# EAGLE design arduino_fio (EAGLE 5.00)
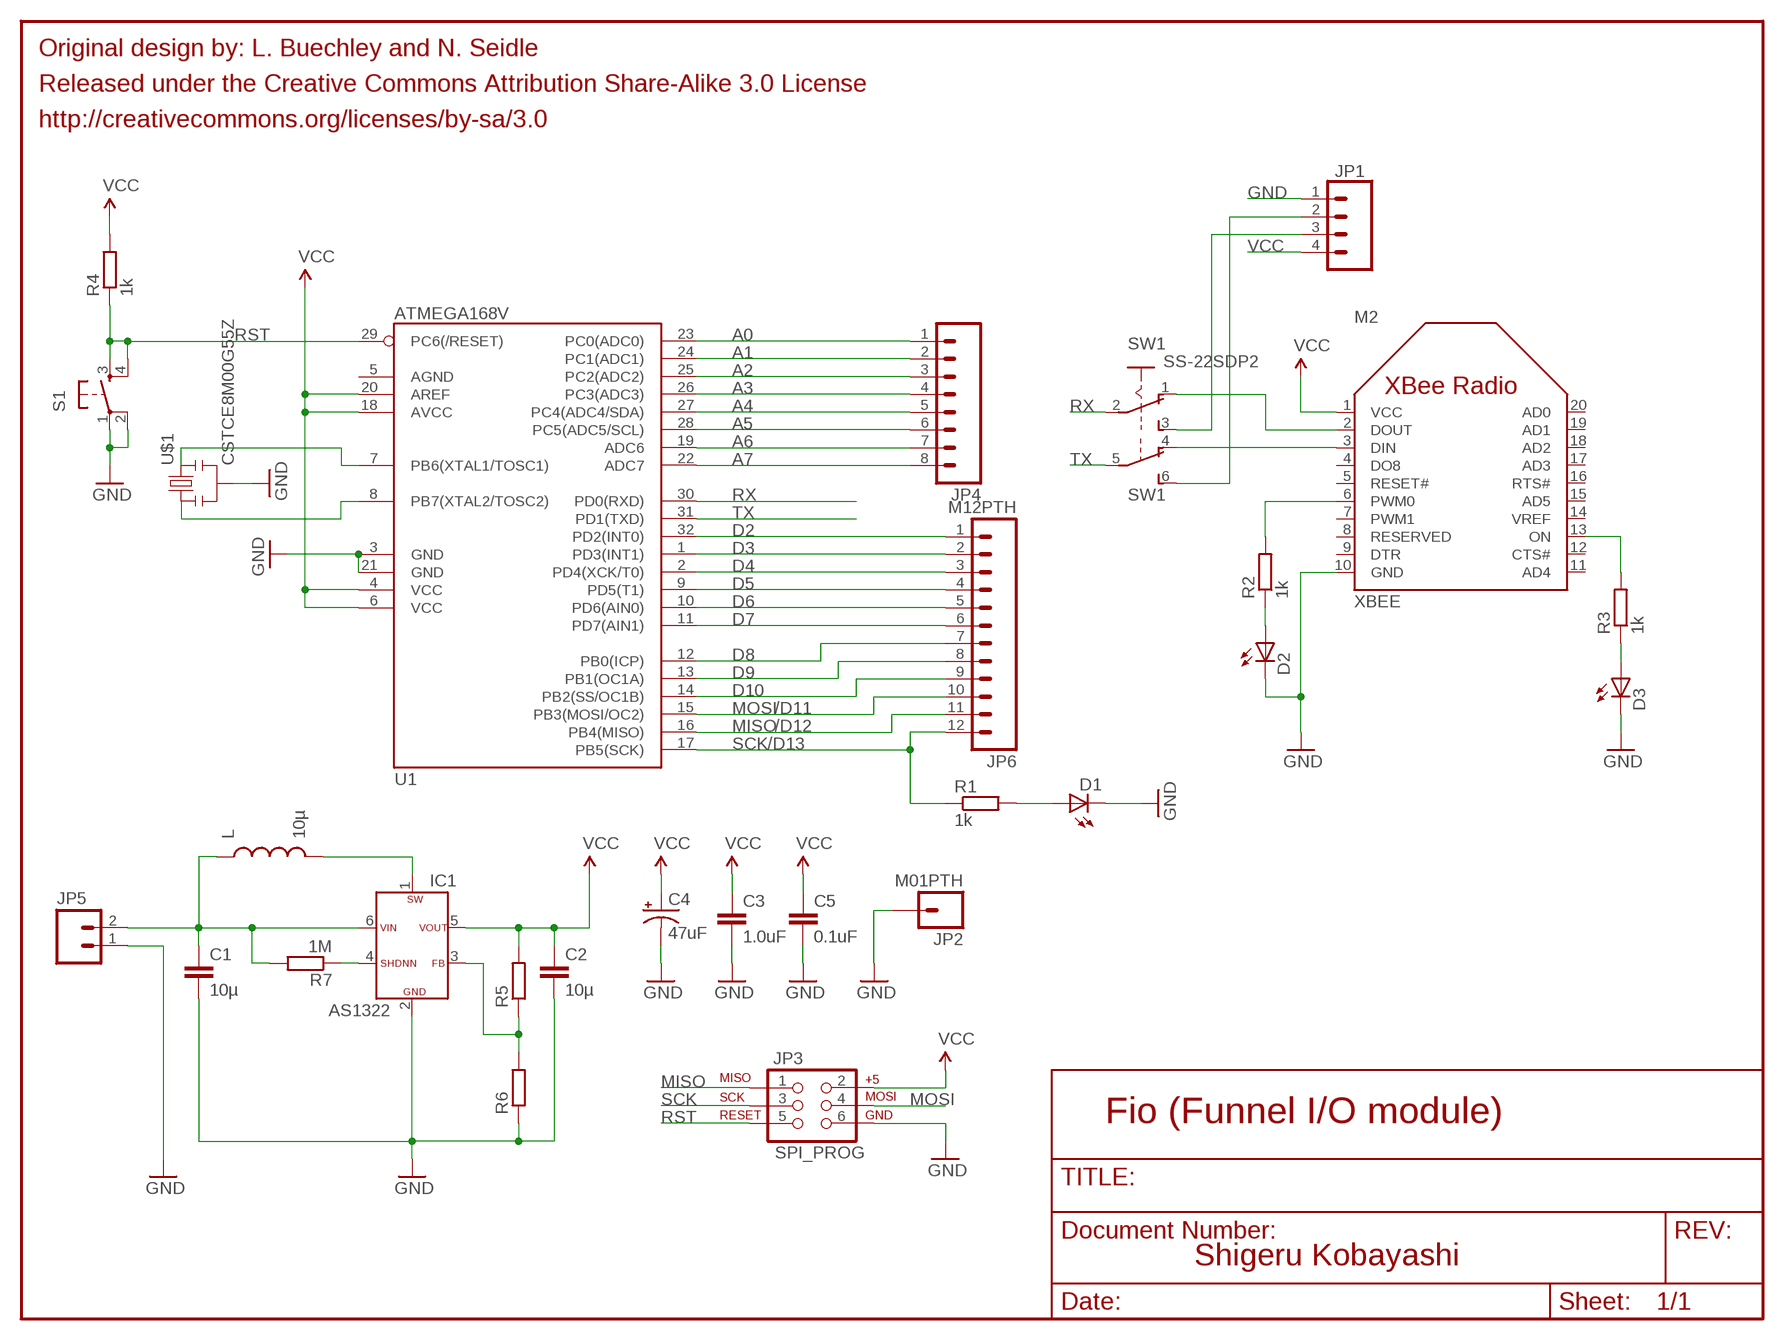
[diagram p0: schematic, sheet 1]

## Parts
C1  10µ  C-EUC0805K  [C0805K]
C2  10µ  C-EUC0805K  [C0805K]
C3  1.0uF  CAP0603  [0603]
C4  47uF  CAP_POL3528  [EIA3528]
C5  0.1uF  CAP0603  [0603]
D1  LEDCHIPLED_0805  [CHIPLED_0805]
D2  LEDCHIPLED_0805  [CHIPLED_0805]
D3  LEDCHIPLED_0805  [CHIPLED_0805]
IC1  AS1322  [SOT23-6]
JP1  Serial  M04PTH  [1X04]
JP2  M01PTH  [1X01]
JP3  SPI_PROG  AVR_SPI_PRG_6NS  [2X3-NS]
JP4  M08  [1X08]
JP5  M02-JST-2MM-SMT  [S2B-PH]
JP6  M12PTH  [1X12]
L  10µ  A921CY  [D63LCB]
M2  XBEE  [XBEE]
R1  1k  R-EU_R0603  [R0603]
R2  1k  R-EU_R0603  [R0603]
R3  1k  R-EU_R0603  [R0603]
R4  1k  R-EU_R0603  [R0603]
R5  R-EU_R0603  [R0603]
R6  R-EU_R0603  [R0603]
R7  1M  R-EU_R0603  [R0603]
S1  TAC_SWITCHSND  [TACTILE_SWITCH_SMD]
SW1  SS-22SDP2  [SS-22SDP2]
U1  ATMEGA168V  ATMEGA168  [TQFP32-08]
U$1  CSTCE8M00G55Z  RESONATORSMD  [RESONATOR-SMD]

## Nets
A0: JP4.1 U1.23(PC0(ADC0))
A1: JP4.2 U1.24(PC1(ADC1))
A2: JP4.3 U1.25(PC2(ADC2))
A3: JP4.4 U1.26(PC3(ADC3))
A4: JP4.5 U1.27(PC4(ADC4/SDA))
A5: JP4.6 U1.28(PC5(ADC5/SCL))
A6: JP4.7 U1.19(ADC6)
A7: JP4.8 U1.22(ADC7)
D2: JP6.1 U1.32(PD2(INT0))
D3: JP6.2 U1.1(PD3(INT1))
D4: JP6.3 U1.2(PD4(XCK/T0))
D5: JP6.4 U1.9(PD5(T1))
D6: JP6.5 U1.10(PD6(AIN0))
D7: JP6.6 U1.11(PD7(AIN1))
D8: JP6.7 U1.12(PB0(ICP))
D9: JP6.8 U1.13(PB1(OC1A))
D10: JP6.9 U1.14(PB2(SS/OC1B))
GND [VCC]: C1.2 C2.2 C3.2 C4.C(-) C5.2 D1.C D2.C D3.C IC1.2(GND) JP1.1 JP2.1 JP3.6 JP5.1 M2.10(GND) R6.1 S1.1 S1.2 U1.3(GND) U1.21(GND) U$1.2
MISO: JP3.1 JP6.11 U1.16(PB4(MISO))
MOSI: JP3.4 JP6.10 U1.15(PB3(MOSI/OC2))
N$1: M2.13(ON) R3.2
N$2: D1.A R1.2
N$3: D2.A R2.1
N$4: M2.6(PWM0) R2.2
N$5: M2.2(DOUT) SW1.1(O)
N$6: D3.A R3.1
N$7: M2.3(DIN) SW1.4(O)
N$8: JP1.2 SW1.6(S)
N$9: JP1.3 SW1.3(S)
N$10: U1.7(PB6(XTAL1/TOSC1)) U$1.3
N$11: IC1.3(FB) R5.1 R6.2
N$12: U1.8(PB7(XTAL2/TOSC2)) U$1.1
N$13: C1.1 IC1.6(VIN) JP5.2 L.P$1 R7.2
N$14: IC1.1(SW) L.P$2
N$15: IC1.4(SHDNN) R7.1
RST: JP3.5 R4.1 S1.3 S1.4 U1.29(PC6(/RESET))
RX: SW1.2(P) U1.30(PD0(RXD))
SCK: JP3.3 JP6.12 R1.1 U1.17(PB5(SCK))
TX: SW1.5(P) U1.31(PD1(TXD))
VCC [VCC]: C2.1 C3.1 C4.A(+) C5.1 IC1.5(VOUT) JP1.4 JP3.2 M2.1(VCC) R4.2 R5.2 U1.4(VCC) U1.6(VCC) U1.18(AVCC) U1.20(AREF)
Unconnected: M2.4(DO8) M2.5(RESET#) M2.7(PWM1) M2.8(RESERVED) M2.9(DTR) M2.11(AD4) M2.12(CTS#) M2.14(VREF) M2.15(AD5) M2.16(RTS#) M2.17(AD3) M2.18(AD2) M2.19(AD1) M2.20(AD0) U1.5(AGND)

## Notes on the sheet
- Original design by: L. Buechley and N. Seidle
- Released under the Creative Commons Attribution Share-Alike 3.0 License
- http://creativecommons.org/licenses/by-sa/3.0
- /D11
- /D12
- /D13
- Fio (Funnel I/O module)
- Shigeru Kobayashi

## Library data of the parts
C1 C2 = rcl:C-EU: CAPACITOR, European symbol
C3 C5 = SparkFun:CAP: Capacitor Standard 0603 ceramic capacitor, and 0.1" leaded capacitor.
C4 = SparkFun:CAP_POL: Capacitor Polarized These are standard SMD and PTH capacitors. Normally 10uF, 47uF, and 100uF in electrolytic and tantalum varieties. Always verify the external diameter of the through hole cap, it varies with capacity, voltage, and manufacturer. The EIA devices should be standard.
D1-D3 = led:LED: LED OSRAM: - CHIPLED LG R971, LG N971, LY N971, LG Q971, LY Q971, LO R971, LY R971 LH N974, LH R974 LS Q976, LO Q976, LY Q976 LO Q996 - Hyper CHIPLED LW Q18S LB Q993, LB Q99A, LB R99A - SideLED LS A670, LO A670, LY A670, LG A670, LP A670 LB A673, LV A673, LT A673, LW A673 LH A674 LY A675 LS A676, LA A676, LO A676, LY A676, LW A676 LS A679, LY A679, LG A679 - Hyper Micro SIDELED® LS Y876, LA Y876, LO Y876, LY Y876 LT Y87S - SmartLED LW L88C, LW L88S LB L89C, LB L89S, LG L890 LS L89K, LO L89K, LY L89K LS L896, LA L896, LO L896, LY L896 - TOPLED LS T670, LO T670, LY T670, LG T670, LP T670 LSG T670, LSP T670, LSY T670, LOP T670, LYG T670 LG T671, LOG T671, LSG T671 LB T673, LV T673, LT T673, LW T673 LH T674 LS T676, LA T676, LO T676, LY T676, LB T676, LH T676, LSB T676, LW T676 LB T67C, LV T67C, LT T67C, LS T67K, LO T67K, LY T67K, LW E67C LS E67B, LA E67B, LO E67B, LY E67B, LB E67C, LV E67C, LT E67C LW T67C LS T679, LY T679, LG T679 LS T770, LO T770, LY T770, LG T770, LP T770 LB T773, LV T773, LT T773, LW T773 LH T774 LS E675, LA E675, LY E675, LS T675 LS T776, LA T776, LO T776, LY T776, LB T776 LHGB T686 LT T68C, LB T68C - Hyper Mini TOPLED® LB M676 - Mini TOPLED Santana® LG M470 LS M47K, LO M47K, LY M47K Source: http://www.osram.convergy.de - LUMILED® LXK2-PW12-R00, LXK2-PW12-S00, LXK2-PW14-U00, LXK2-PW14-V00 LXK2-PM12-R00, LXK2-PM12-S00, LXK2-PM14-U00 LXK2-PE12-Q00, LXK2-PE12-R00, LXK2-PE12-S00, LXK2-PE14-T00, LXK2-PE14-U00 LXK2-PB12-K00, LXK2-PB12-L00, LXK2-PB12-M00, LXK2-PB14-N00, LXK2-PB14-P00, LXK2-PB14-Q00 LXK2-PR12-L00, LXK2-PR12-M00, LXK2-PR14-Q00, LXK2-PR14-R00 LXK2-PD12-Q00, LXK2-PD12-R00, LXK2-PD12-S00 LXK2-PH12-R00, LXK2-PH12-S00 LXK2-PL12-P00, LXK2-PL12-Q00, LXK2-PL12-R00 Source: www.luxeon.com
IC1 = austriamicrosystems_as1322:AS1322
JP1 = SparkFun:M04: Header 4 Standard 4-pin 0.1" header. Use with straight break away headers (SKU : PRT-00116), right angle break away headers (PRT-00553), swiss pins (PRT-00743), machine pins (PRT-00117), and female headers (PRT-00115). Molex polarized connector foot print use with SKU : PRT-08231 with associated crimp pins and housings.
JP2 = SparkFun:M01: Header 1 Standard 1-pin 0.1" header. Use with straight break away headers (SKU : PRT-00116), right angle break away headers (PRT-00553), swiss pins (PRT-00743), machine pins (PRT-00117), and female headers (PRT-00115).
JP3 = SparkFun:AVR_SPI_PRG_6
JP4 = SparkFun:M08: Header 8 Standard 8-pin 0.1" header. Use with straight break away headers (SKU : PRT-00116), right angle break away headers (PRT-00553), swiss pins (PRT-00743), machine pins (PRT-00117), and female headers (PRT-00115).
JP5 = SparkFun:M02: Header 2 Standard 2-pin 0.1" header. Use with straight break away headers (SKU : PRT-00116), right angle break away headers (PRT-00553), swiss pins (PRT-00743), machine pins (PRT-00117), and female headers (PRT-00115). Molex polarized connector foot print use with SKU : PRT-08233 with associated crimp pins and housings.
JP6 = SparkFun:M12: Header 12 Standard 12-pin 0.1" header. Use with straight break away headers (SKU : PRT-00116), right angle break away headers (PRT-00553), swiss pins (PRT-00743), machine pins (PRT-00117), and female headers (PRT-00115).
L = inductor_toko:A921CY
M2 = digi_xbee:XBEE
R1-R7 = rcl:R-EU_: RESISTOR, European symbol
S1 = SparkFun:TAC_SWITCH: Momentary Switch Button commonly used for reset or general input. Spark Fun Electronics SKU : COM-00097
SW1 = nikkai_ss:SS-22S
U1 = SparkFun:ATMEGA168
U$1 = SparkFun:RESONATOR: Resonator Small SMD resonator. This is the itty bitty 10/20MHz resonators with built in caps. CSTCE10M0G55 and CSTCE20M0V53. Footprint has been reviewed closely but hasn't been tested yet.

## Net classes
0 Default: width 0.203 mm
1 VCC: width 0.381 mm
2 LEDPower: width 0.203 mm
3 ButtonSignal: width 0.203 mm

## Board
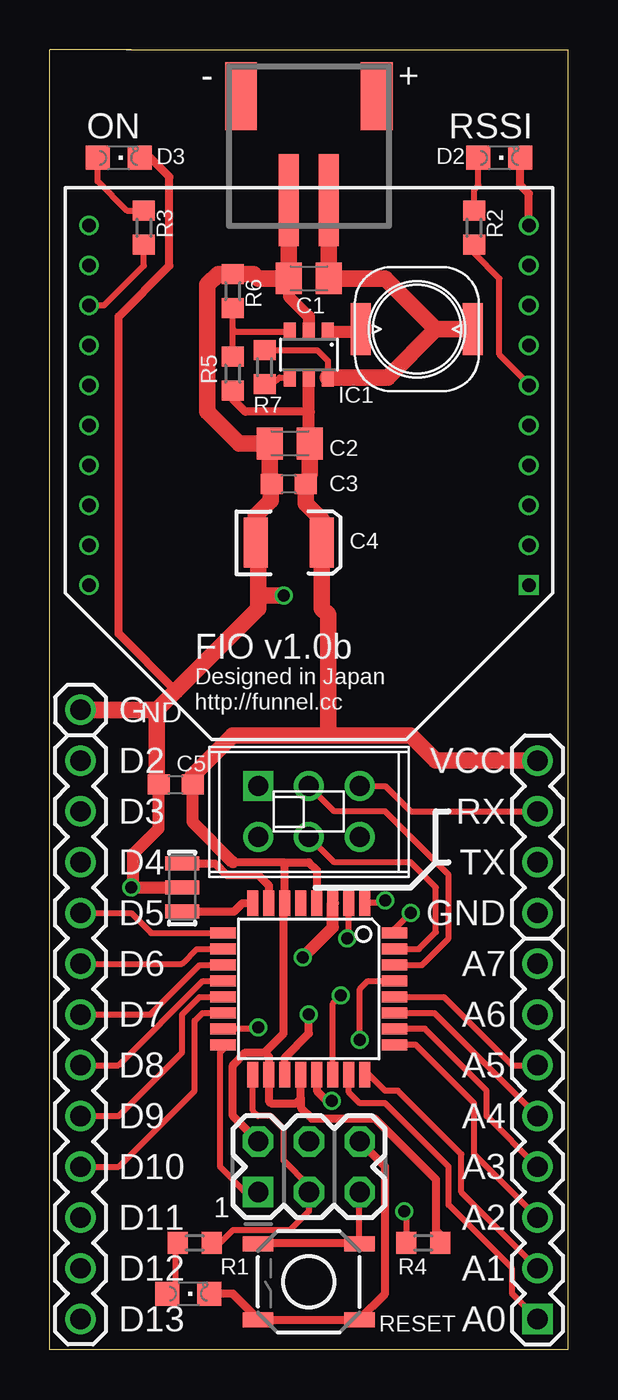
[diagram p1: board, top side]
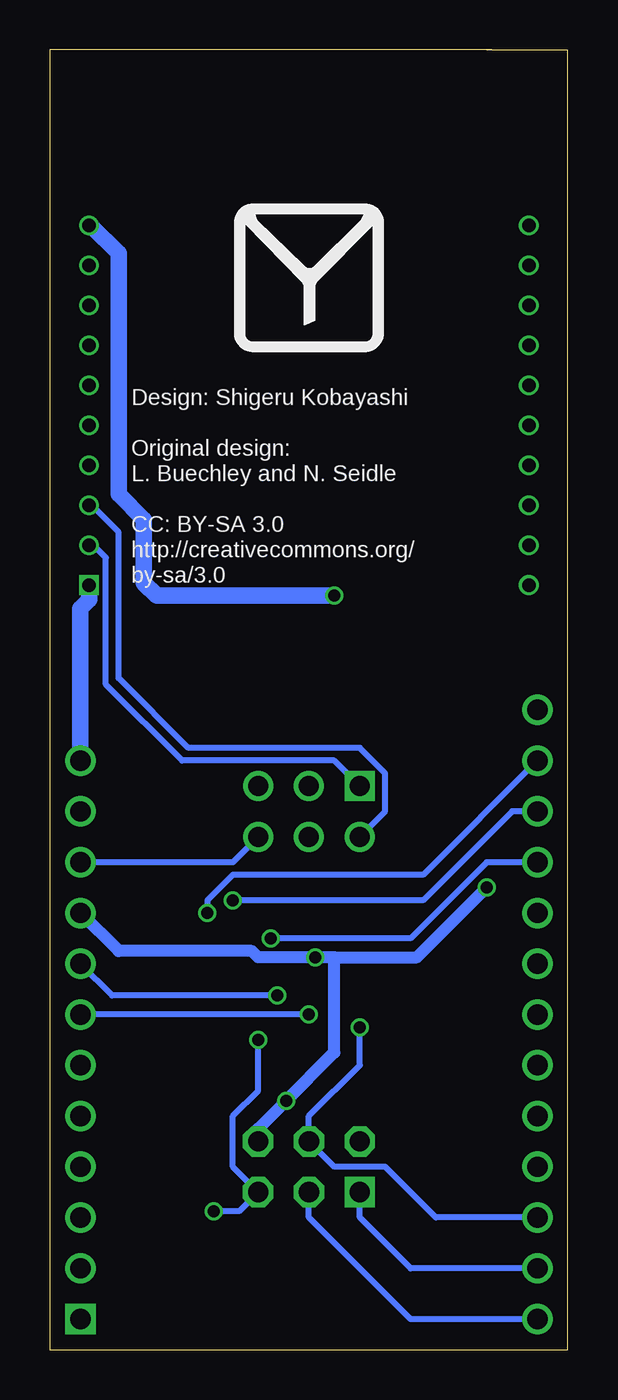
[diagram p2: board, bottom side, seen from below]

Size 25.91 x 65.02 mm. Coordinates in mm from the lower left corner, seen from the top.
Outline: 3.81,65.02 4.06,65.02
Outline: 4.06,65.02 25.91,65.02 25.91,0 0,0 0,65.02 4.06,65.02
Copper layers (1*16): Top 0.035mm / dielectric 1.5mm / Bottom 0.035mm
Design rules "p_ban_2layer *": minimum track width 5mil, minimum drill 0.3mm, track to track 5mil, track to pad 5mil, pad to pad 5mil, via to via 5mil, smd to smd 5mil, copper to edge 0.5mm, drill to drill 0.3mm, minimum pad ring 0.15mm, minimum via ring 0.15mm, stop-mask expansion 4mil, vias tented up to drill 0.35mm, thermal gap 10mil

### Footprints (pad centres in the part's own frame; a part is rotated, then mirrored left to right if it is on the bottom)
C0805K = smd 1.3 x 1.6: 1 -1,0; 2 1,0
0603 = smd 1.1 x 1: 1 -0.85,0; 2 0.85,0
EIA3528 = smd 1.2 x 2.5: A 1.65,0; C -1.65,0
CHIPLED_0805 = smd 1.2 x 1.2: A 0,-1.05; C 0,1.05
SOT23-6 = smd 0.6 x 0.9: 1 -0.95,-1.15; 2 0,-1.15; 3 0.95,-1.15; 4 0.95,1.15; 5 0,1.15; 6 -0.95,1.15
1X04 = drill 1.016 round: 1 0,0; 2 2.54,0; 3 5.08,0; 4 7.62,0
1X01 = drill 1.016 round: 1 0,0
2X3-NS = drill 1.016 square: 1 -2.54,-1.27 | drill 1.016 octagon: 2 -2.54,1.27; 3 0,-1.27; 4 0,1.27; 5 2.54,-1.27; 6 2.54,1.27
1X08 = drill 1.016 square: 1 0,0 | drill 1.016 round: 2 2.54,0; 3 5.08,0; 4 7.62,0; 5 10.16,0; 6 12.7,0; 7 15.24,0; 8 17.78,0
S2B-PH = smd 1 x 4.6: 1 -1,-3.7; 2 1,-3.7 | smd 1.6 x 3.4: P$1 -3.4,1.5; P$2 3.4,1.5
1X12 = drill 1.016 round: 1 0,0; 2 2.54,0; 3 5.08,0; 4 7.62,0; 5 10.16,0; 6 12.7,0; 7 15.24,0; 8 17.78,0; 9 20.32,0; 10 22.86,0; 11 25.4,0; 12 27.94,0
D63LCB = smd 1 x 2.6: P$1 -2.8,0; P$2 2.8,0
XBEE = drill 0.66 square: 1 -11,9 | drill 0.66 round: 2 -11,7; 3 -11,5; 4 -11,3; 5 -11,1; 6 -11,-1; 7 -11,-3; 8 -11,-5; 9 -11,-7; 10 -11,-9; 11 11,-9; 12 11,-7; 13 11,-5; 14 11,-3; 15 11,-1; 16 11,1; 17 11,3; 18 11,5; 19 11,7; 20 11,9
R0603 = smd 1 x 1.1: 1 -0.85,0; 2 0.85,0
TACTILE_SWITCH_SMD = smd 1.524 x 0.762: 1 -2.54,1.905; 2 2.54,1.905; 3 -2.54,-1.905; 4 2.54,-1.905
SS-22SDP2 = drill 1 square: 1 -2.54,1.27 | drill 1 round: 2 0,1.27; 3 2.54,1.27; 4 -2.54,-1.27; 5 0,-1.27; 6 2.54,-1.27
TQFP32-08 = smd 1.27 x 0.559: 1 -4.293,2.8; 2 -4.293,2; 3 -4.293,1.2; 4 -4.293,0.4; 5 -4.293,-0.4; 6 -4.293,-1.2; 7 -4.293,-2; 8 -4.293,-2.8; 17 4.293,-2.8; 18 4.293,-2; 19 4.293,-1.2; 20 4.293,-0.4; 21 4.293,0.4; 22 4.293,1.2; 23 4.293,2; 24 4.293,2.8 | smd 0.559 x 1.27: 9 -2.8,-4.293; 10 -2,-4.293; 11 -1.2,-4.293; 12 -0.4,-4.293; 13 0.4,-4.293; 14 1.2,-4.293; 15 2,-4.293; 16 2.8,-4.293; 25 2.8,4.293; 26 2,4.293; 27 1.2,4.293; 28 0.4,4.293; 29 -0.4,4.293; 30 -1.2,4.293; 31 -2,4.293; 32 -2.8,4.293
RESONATOR-SMD = smd 0.7 x 1.7: 1 -1.2,0; 2 0,0; 3 1.2,0

### Placement (x,y rotation side)
C1  12.95,53.59 180 top
C2  12,45.34 180 top
C3  11.94,43.31 180 top
C4  11.94,40.39 0 top
C5  6.28,28.26 180 top
D1  6.92,2.79 270 top
D2  22.48,59.63 270 top
D3  3.43,59.63 270 top
IC1  12.95,49.78 180 top
JP1  24.38,21.84 90 top
JP2  1.52,32 0 top
JP3  12.95,9.14 0 top
JP4  24.38,1.52 90 top
JP5  12.95,61.21 0 top
JP6  1.52,29.46 270 top
L  18.35,51.05 180 top
M2  12.95,47.24 180 top
R1  7.24,5.33 180 top
R2  21.21,56.13 270 top
R3  4.7,56.13 270 top
R4  18.67,5.33 0 top
R5  9.14,48.83 270 top
R6  9.14,52.96 270 top
R7  10.73,49.15 90 top
S1  12.94,3.39 180 top
SW1  12.95,26.92 0 top
U1  12.94,18.04 270 top
U$1  6.6,23.11 90 top
U$2  [FUNNEL_LOGO_BOTTOM]  12.95,53.59 0 top

### Tracks (layer width: path | path; a pad name or v marks a point on that pad's centre or on a via)
A0
  Top 0.305: U1.23 14.94,12.87 15.49,12.32 16.76,12.32 19.94,9.14 19.94,7.24 23.11,4.06 23.11,2.79 JP4.1
A1
  Top 0.305: U1.24 15.97,13.75 16.76,12.95 17.4,12.95 20.57,9.78 20.57,7.87 JP4.2
A2
  Top 0.305: U1.25 18.28,15.24 21.21,12.32 21.21,9.78 JP4.3
A3
  Top 0.305: U1.26 18.75,16.04 21.84,12.95 21.84,11.68 JP4.4
A4
  Top 0.305: U1.27 19.22,16.84 JP4.5
A5
  Top 0.305: U1.28 19.69,17.64 23.11,14.22 JP4.6
A6  (via drill 0.6)
  Top 0.406: U1.19 11.74,14.6 12.95,15.81 v12.95,16.76
  Bottom 0.305: v12.95,16.76 JP4.7
A7  (via drill 0.6)
  Top 0.305: U1.22 14.14,17.32 v14.54,17.72
  Bottom 0.305: v14.54,17.72 22.8,17.72 JP4.8
D2  (via drill 0.6)
  Top 0.305: U1.32 17.24,21.05 v18.03,21.84
  Bottom 0.305: v18.03,21.84 18.03,22.48 16.76,23.75 7.24,23.75 JP6.1
D3  (via drill 0.6)
  Top 0.305: U1.1 16.62,22.34 v16.76,22.48
  Bottom 0.305: v16.76,22.48 7.24,22.48 2.79,26.92 JP6.2
D4  (via drill 0.6)
  Top 0.305: U1.2 14.94,20.66 v14.86,20.57
  Bottom 0.305: v14.86,20.57 7.87,20.57 4.06,24.38 JP6.3
D5
  Top 0.305: U1.9 5.06,20.84 4.06,21.84 JP6.4
D6
  Top 0.305: U1.10 7.34,20.04 6.6,19.3 JP6.5
D7
  Top 0.305: U1.11 7.5,19.24 5.02,16.76 JP6.6
D8
  Top 0.305: U1.12 7.65,18.44 3.43,14.22 JP6.7
D9
  Top 0.305: U1.13 7.48,17.64 6.6,16.76 6.6,14.86 3.43,11.68 JP6.8
D10
  Top 0.305: U1.14 7.64,16.84 7.24,16.45 7.24,12.95 3.43,9.14 JP6.9
GND  (via drill 0.6)
  Top 0.406: 15.48,1.51 S1.1 | 15.48,1.51 15.46,1.49 10.41,1.49 | JP3.6 16.76,9.14 16.76,2.79 15.48,1.51 | 10.41,1.49 S1.2 10.4,1.51 10.41,1.52 | 10.41,1.49 10.41,1.52 | D1.C 9.14,2.79 10.41,1.52 | 11.05,43.12 11.09,43.16 C3.2 11.09,43.39 | 11.68,53.59 11.95,53.86 | D2.C 23.53,58.26 23.95,57.83 M2.10 | D3.C 5.02,59.63 5.97,58.67 5.97,54.23 3.43,51.69 3.43,35.81 6.29,32.96 | v14.1,12.45 13.84,12.45 13.34,12.95 U1.21
  Top 0.61: U$1.2 v4.06,23.11 4.16,23.21 4.16,24.8 5.43,26.07 C5.2 | U1.3 14.14,21.13 v12.64,19.62 | IC1.2 12.95,51.69 11.95,52.69 C1.2 | C2.2 11.05,45.34 | C5.2 5.4,28.26 5.33,28.19 5.36,28.19 C5.2 | 10.41,40.26 C4.C | 11.09,43.39 11,43.48
  Top 0.813: C1.2 11.68,53.59 10.41,53.59 10.2,53.81 R6.1 8.41,53.81 7.87,53.28 7.87,46.93 9.46,45.34 C2.2 11,43.48 | C4.C 10.29,41.72 11.05,42.48 11.05,43.12 | 11.95,53.86 JP5.1 | 5.33,32 JP2.1 | 5.33,32 6.29,32.96 10.41,37.08 10.41,37.72 | 10.41,37.72 10.41,40.26 | 5.33,28.19 5.33,32 | 10.41,37.72 v11.68,37.72
  Bottom 0.61: 14.22,12.32 15.49,11.05 JP3.6 | 14.22,12.32 v14.1,12.45 | 14.22,12.32 11.68,14.86 11.68,19.62 | JP1.1 22.48,19.94 15.81,19.94 15.49,19.62 v12.64,19.62 11.68,19.62 | v4.06,23.11 7.56,19.62 11.68,19.62 | 23.86,56.24 M2.10
  Bottom 0.813: 23.86,56.24 22.48,54.86 22.48,42.8 21.21,41.53 21.21,38.35 20.57,37.72 v11.68,37.72
MISO
  Top 0.305: JP3.1 9.78,7.87 8.51,9.14 8.51,14.86 8.83,15.18 8.76,15.24 U1.16
  Bottom 0.305: JP6.11 7.87,4.06 10.41,6.6 JP3.1
MOSI  (via drill 0.6)
  Top 0.305: U1.15 10.33,16.04 v10.41,16.13
  Bottom 0.305: v10.41,16.13 10.41,14.22 12.95,11.68 JP3.4 11.68,9.14 9.14,9.14 6.6,6.6 JP6.10
N$1
  Top 0.305: M2.13 2.71,52.24 4.7,54.23 R3.2
N$2
  Top 0.305: R1.2 6.29,5.33 6.29,3.11 5.97,2.79 D1.A
N$3
  Top 0.305: R2.1 21.21,58.04 21.43,58.26 D2.A
N$4
  Top 0.305: R2.2 21.21,54.86 22.48,53.59 22.48,49.78 23.95,48.31 M2.6
N$5
  Bottom 0.305: SW1.1 11.68,29.46 19.3,29.46 23.11,33.27 23.11,39.62 23.73,40.24 M2.2
N$6
  Top 0.305: R3.1 3.85,56.98 2.38,58.45 D3.A
N$7
  Bottom 0.305: SW1.4 9.14,26.92 9.14,28.83 10.41,30.1 18.99,30.1 22.48,33.59 22.48,40.89 23.83,42.24 M2.3
N$8
  Bottom 0.305: SW1.6 16.76,24.38 JP1.2
N$9
  Top 0.305: SW1.3 16.76,28.19 18.03,26.92 JP1.3
N$10
  Top 0.406: 10.94,22.69 U1.7 10.94,23.22 10.41,23.75 8.83,23.75 8.26,24.31 U$1.3
N$11
  Top 0.305: R5.1 9.14,51.05 | 9.14,51.05 9.14,52.01 | IC1.3 9.26,50.93 9.14,51.05
  Top 0.406: R6.2 9.14,52.01 9.25,51.9
N$12
  Top 0.406: U1.8 9.64,22.34 9.21,21.91 U$1.1
N$13
  Top 0.305: 14.22,53.59 13.95,53.86 | R7.2 13.37,50 13.91,49.47 13.9,49.46 IC1.6
  Top 0.61: 14.22,53.59 C1.1
  Top 0.813: 19.3,51.05 L.P$1 | 19.3,51.05 16.76,53.59 14.22,53.59 | IC1.6 16.88,48.63 19.3,51.05 | 13.95,53.86 JP5.2
N$14
  Top 0.406: L.P$2 15.49,51.05 15.37,50.93
  Top 0.61: IC1.1 15.37,50.93
N$15
  Top 0.305: R7.1 11.15,48.3 11.49,48.63 IC1.4
RST  (via drill 0.6)
  Top 0.305: U1.29 15.9,18.44 15.49,18.03 v15.49,15.49 | 10.41,5.33 10.4,5.32 S1.4 | 15.49,5.33 15.48,5.32 | 15.48,5.32 S1.3 15.48,7.86 JP3.5 | 15.48,5.32 15.46,5.29 | R4.1 17.82,6.82 v17.72,6.92
  Top 0.406: S1.3 15.49,5.29 15.49,5.33 10.41,5.33
  Bottom 0.305: v15.49,15.49 15.49,12.95 16.76,11.68 16.76,9.14 JP3.5 16.45,6.92 v17.72,6.92
RX
  Top 0.305: U1.30 18.61,19.24 19.94,20.57 19.94,23.75 16.76,26.92 14.22,26.92 SW1.2
SCK
  Top 0.305: R1.1 8.51,5.33 9.14,5.97 12,5.97 12.95,6.92 JP3.3 12.95,8.19 11.68,9.46 11.68,11.05 11.05,11.68 10.41,11.68 10.14,11.95 U1.17
  Bottom 0.305: JP6.12 7.87,1.52 12.95,6.6 JP3.3
TX
  Top 0.305: U1.31 18.46,20.04 19.3,20.89 19.3,23.11 18.03,24.38 14.22,24.38 SW1.5
VCC
  Top 0.406: JP3.2 9.14,11.68 9.14,14.22 9.78,14.86 10.73,14.86 | 12.54,12.54 U1.20 | 12.54,12.54 12.32,12.32 11.05,12.32 10.94,12.42 U1.18 10.94,14.65 10.73,14.86 | 11.68,24.38 9.14,24.38 | 11.68,24.38 11.74,24.32 U1.6 11.74,22.42 11.68,22.48 11.68,15.81 10.73,14.86 | U1.4 13.34,23.99 12.95,24.38 11.68,24.38 | 12.54,12.54 12.54,12.09 13.08,11.56 16.26,11.56 19.3,8.51 19.3,5.97 19.62,5.65 19.52,5.55 R4.2 | C5.1 7.13,28.72 | C2.1 12.95,45.34 | 13.59,40.58 | R5.2 9.14,47.56 9.78,46.93 12.95,46.93 | C3.1 12.76,43.31 12.64,43.43 13,43.8
  Top 0.61: C5.1 7.13,26.4 9.14,24.38 | 12.95,45.34 12.95,46.93 IC1.5 | 13.59,40.58 13.59,41.53
  Top 0.813: 13.91,30.73 9.14,30.73 7.13,28.72 | 13.91,30.73 18.03,30.73 19.3,29.46 JP1.4 | C3.1 12.79,42.33 13.59,41.53 | 13.59,40.58 C4.A 13.59,37.09 13.91,36.77 13.91,30.73 | 13,43.8 C2.1
  Bottom 0.406: 23.86,38.24 23.75,38.35 | 23.86,38.24 M2.1 | 23.95,38.15 23.86,38.24
  Bottom 0.813: JP1.4 24.38,37.08 23.95,37.51 23.95,38.15

### Text on the board
tPlace: - | + | ON | RSSI | FIO v1.0b | Designed in Japan | http://funnel.cc | G | ND | VCC | D2 | RX | D3 | TX | D4 | GND | D5 | A7 | D6 | A6 | D7 | A5 | D8 | A4 | D9 | A3 | D10 | A2 | D11 | 1 | A1 | D12 | A0 | D13 | RESET
bPlace: Design: Shigeru Kobayashi | Original design: | L. Buechley and N. Seidle | CC: BY-SA 3.0 | http://creativecommons.org/ | by-sa/3.0